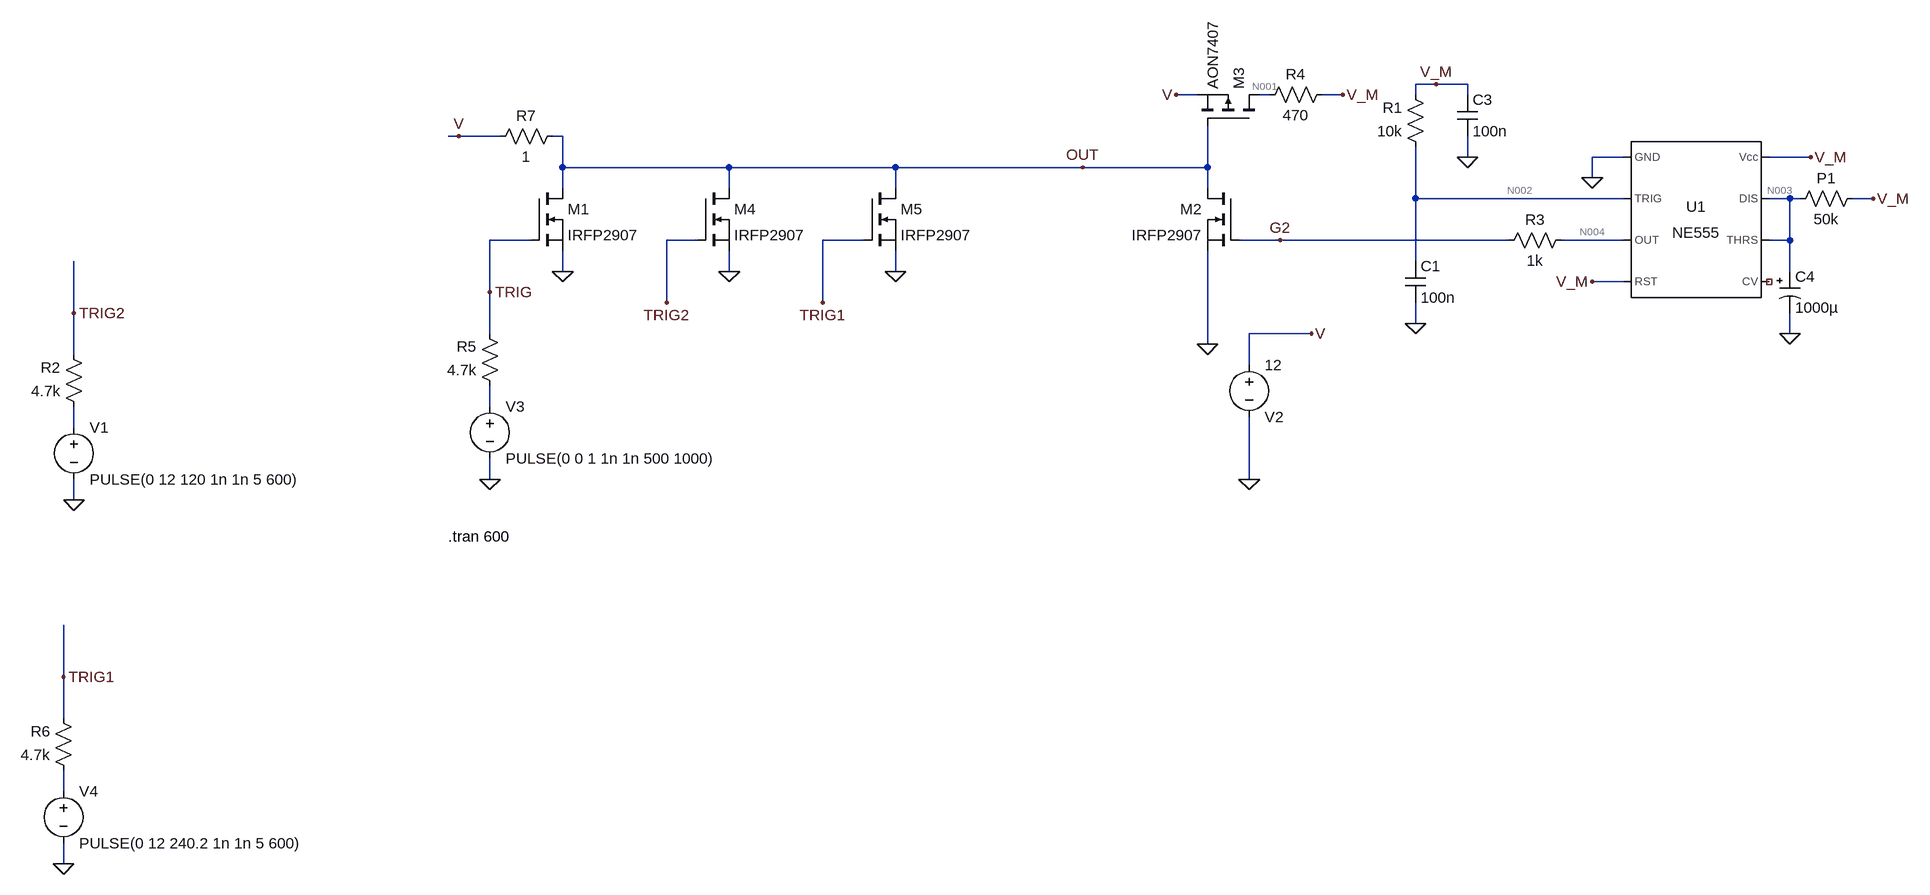
[diagram p0: schematic Draft1.asc]
Draft1.asc, the LTspice schematic file:
Version 4
SHEET 1 4328 1372
WIRE 496 64 464 64
WIRE 544 64 496 64
WIRE 128 80 96 80
WIRE 240 80 224 80
WIRE 352 80 320 80
WIRE 464 80 464 64
WIRE 544 80 544 64
WIRE -1008 144 -1024 144
WIRE -944 144 -1008 144
WIRE -848 144 -864 144
WIRE 544 176 544 144
WIRE 784 176 736 176
WIRE 1072 176 1008 176
WIRE -848 192 -848 144
WIRE -592 192 -848 192
WIRE -336 192 -592 192
WIRE -48 192 -336 192
WIRE 144 192 144 128
WIRE 144 192 -48 192
WIRE 736 208 736 176
WIRE -848 224 -848 192
WIRE -592 224 -592 192
WIRE -336 224 -336 192
WIRE 144 224 144 192
WIRE 464 240 464 160
WIRE 784 240 464 240
WIRE 1040 240 1008 240
WIRE 1056 240 1040 240
WIRE 1168 240 1136 240
WIRE -896 304 -960 304
WIRE -640 304 -688 304
WIRE -384 304 -448 304
WIRE 256 304 192 304
WIRE 608 304 256 304
WIRE 784 304 688 304
WIRE 1040 304 1040 240
WIRE 1040 304 1008 304
WIRE 464 336 464 240
WIRE -848 352 -848 320
WIRE -592 352 -592 320
WIRE -336 352 -336 320
WIRE 1040 352 1040 304
WIRE 784 368 736 368
WIRE -960 384 -960 304
WIRE -688 400 -688 304
WIRE -448 400 -448 304
WIRE -1600 416 -1600 336
WIRE 464 432 464 400
WIRE -960 448 -960 384
WIRE 304 448 208 448
WIRE 1040 448 1040 416
WIRE 144 464 144 320
WIRE -1600 480 -1600 416
WIRE 208 496 208 448
WIRE -960 560 -960 528
WIRE -1600 592 -1600 560
WIRE -960 672 -960 640
WIRE 208 672 208 576
WIRE -1600 704 -1600 672
WIRE -1616 976 -1616 896
WIRE -1616 1040 -1616 976
WIRE -1616 1152 -1616 1120
WIRE -1616 1264 -1616 1232
FLAG 208 672 0
FLAG 304 448 V
FLAG 144 464 0
FLAG 96 80 V
FLAG 736 208 0
FLAG 464 432 0
FLAG 352 80 V_M
FLAG 1072 176 V_M
FLAG 1168 240 V_M
FLAG 1040 448 0
FLAG -960 672 0
FLAG -1008 144 V
FLAG -848 352 0
FLAG 544 176 0
FLAG 736 368 V_M
FLAG 496 64 V_M
FLAG -960 384 TRIG
FLAG -48 192 OUT
FLAG 256 304 G2
FLAG -592 352 0
FLAG -336 352 0
FLAG -1600 704 0
FLAG -1600 416 TRIG2
FLAG -1616 1264 0
FLAG -1616 976 TRIG1
FLAG -688 400 TRIG2
FLAG -448 400 TRIG1
SYMBOL voltage 208 480 R0
WINDOW 0 24 96 Left 2
WINDOW 3 24 16 Left 2
WINDOW 123 0 0 Left 0
WINDOW 39 0 0 Left 0
SYMATTR InstName V2
SYMATTR Value 12
SYMBOL Misc\\NE555 896 272 R0
SYMATTR InstName U1
SYMBOL nmos 192 224 M0
SYMATTR InstName M2
SYMATTR Value IRFP2907
SYMBOL cap 448 336 R0
SYMATTR InstName C1
SYMATTR Value 100n
SYMBOL res 1152 224 R90
WINDOW 0 0 56 VBottom 2
WINDOW 3 32 56 VTop 2
SYMATTR InstName P1
SYMATTR Value 50k
SYMBOL pmos 224 128 M270
SYMATTR InstName M3
SYMATTR Value AON7407
SYMBOL nmos -896 224 R0
SYMATTR InstName M1
SYMATTR Value IRFP2907
SYMBOL res -944 544 R180
WINDOW 0 36 76 Left 2
WINDOW 3 36 40 Left 2
SYMATTR InstName R5
SYMATTR Value 4.7k
SYMBOL res -848 128 R90
WINDOW 0 0 56 VBottom 2
WINDOW 3 32 56 VTop 2
SYMATTR InstName R7
SYMATTR Value 1
SYMBOL res 480 176 R180
WINDOW 0 36 76 Left 2
WINDOW 3 36 40 Left 2
SYMATTR InstName R1
SYMATTR Value 10k
SYMBOL cap 528 80 R0
SYMATTR InstName C3
SYMATTR Value 100n
SYMBOL res 592 320 R270
WINDOW 0 32 56 VTop 2
WINDOW 3 0 56 VBottom 2
SYMATTR InstName R3
SYMATTR Value 1k
SYMBOL polcap 1024 352 R0
SYMATTR InstName C4
SYMATTR Value 1000µ
SYMBOL res 336 64 R90
WINDOW 0 0 56 VBottom 2
WINDOW 3 32 56 VTop 2
SYMATTR InstName R4
SYMATTR Value 470
SYMBOL nmos -640 224 R0
SYMATTR InstName M4
SYMATTR Value IRFP2907
SYMBOL nmos -384 224 R0
SYMATTR InstName M5
SYMATTR Value IRFP2907
SYMBOL voltage -1600 576 R0
WINDOW 123 0 0 Left 0
WINDOW 39 0 0 Left 0
SYMATTR InstName V1
SYMATTR Value PULSE(0 12 120 1n 1n 5 600)
SYMBOL res -1584 576 R180
WINDOW 0 36 76 Left 2
WINDOW 3 36 40 Left 2
SYMATTR InstName R2
SYMATTR Value 4.7k
SYMBOL voltage -1616 1136 R0
WINDOW 123 0 0 Left 0
WINDOW 39 0 0 Left 0
SYMATTR InstName V4
SYMATTR Value PULSE(0 12 240.2 1n 1n 5 600)
SYMBOL res -1600 1136 R180
WINDOW 0 36 76 Left 2
WINDOW 3 36 40 Left 2
SYMATTR InstName R6
SYMATTR Value 4.7k
SYMBOL voltage -960 544 R0
WINDOW 123 0 0 Left 0
WINDOW 39 0 0 Left 0
SYMATTR InstName V3
SYMATTR Value PULSE(0 0 1 1n 1n 500 1000)
TEXT -1024 760 Left 2 !.tran 600

The netlist it stands for:
* Draft1.asc
V2 V 0 12
XU1 0 N002 N004 V_M NC_01 N003 N003 V_M NE555  ; pins GND TRIG OUT RST CV THRS DIS Vcc
M2 OUT G2 0 0 IRFP2907
C1 N002 0 100n
R§P1 V_M N003 50k
M3 N001 OUT V V AON7407
M1 OUT TRIG 0 0 IRFP2907
R5 N005 TRIG 4.7k
R7 OUT V 1
R1 N002 V_M 10k
C3 V_M 0 100n
R3 G2 N004 1k
C4 N003 0 1000µ
R4 V_M N001 470
M4 OUT TRIG2 0 0 IRFP2907
M5 OUT TRIG1 0 0 IRFP2907
V1 N006 0 PULSE(0 12 120 1n 1n 5 600)
R2 N006 TRIG2 4.7k
V4 N007 0 PULSE(0 12 240.2 1n 1n 5 600)
R6 N007 TRIG1 4.7k
V3 N005 0 PULSE(0 0 1 1n 1n 500 1000)
.model NMOS NMOS
.model PMOS PMOS
.lib standard.mos
.tran 600
.lib NE555.sub
.backanno
.end

* Results of the author's LTspice run, read from the files saved beside the schematic
* Operating Point, zero values left out:
*   V(v) = 12 V
*   V(n002) = 10.42 V
*   V(v_m) = 10.42 V
*   V(n003) = 10.42 V
*   V(n004) = 10.42 V
*   V(out) = 41 mV
*   V(g2) = 10.42 V
*   V(n001) = 12 V
*   Id(M3) = -3.368 mA
*   Is(M3) = 3.368 mA
*   Id(M5) = 640.9 pA
*   Is(M5) = -640.9 pA
*   Id(M4) = 640.9 pA
*   Is(M4) = -640.9 pA
*   Id(M1) = 640.9 pA
*   Is(M1) = -640.9 pA
*   Id(M2) = 11.96 A
*   Is(M2) = -11.96 A
*   I(R4) = -3.368 mA
*   I(R1) = -10.42 nA
*   I(R7) = -11.96 A
*   I(P1) = 24.31 nA
*   I(V2) = -11.96 A
*   Ix(u1:1) = -3.368 mA
*   Ix(u1:2) = 10.42 nA
*   Ix(u1:4) = 58.78 µA
*   Ix(u1:6) = 10.42 nA
*   Ix(u1:7) = 13.9 nA
*   Ix(u1:8) = 3.309 mA
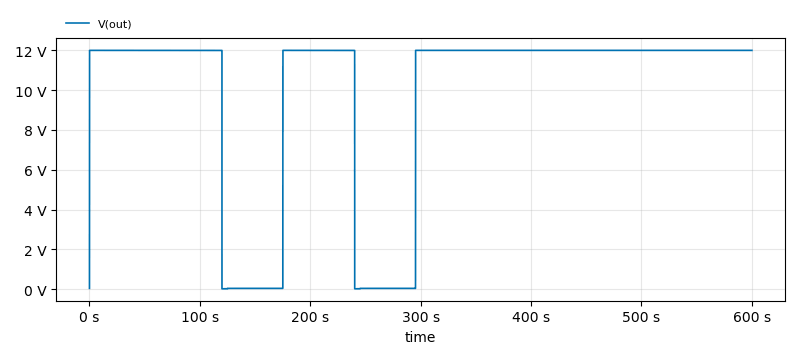
[diagram p1: Transient Analysis of Draft1.asc, plotted from the saved traces]
* Transient Analysis, 1 run:
*   V(out): min 19.8 mV, max 12 V, average 9.802 V, rms 10.84 V, last 12 V